# Altium project Open Source Programmable Load.PrjPcb (part 1 of 2)
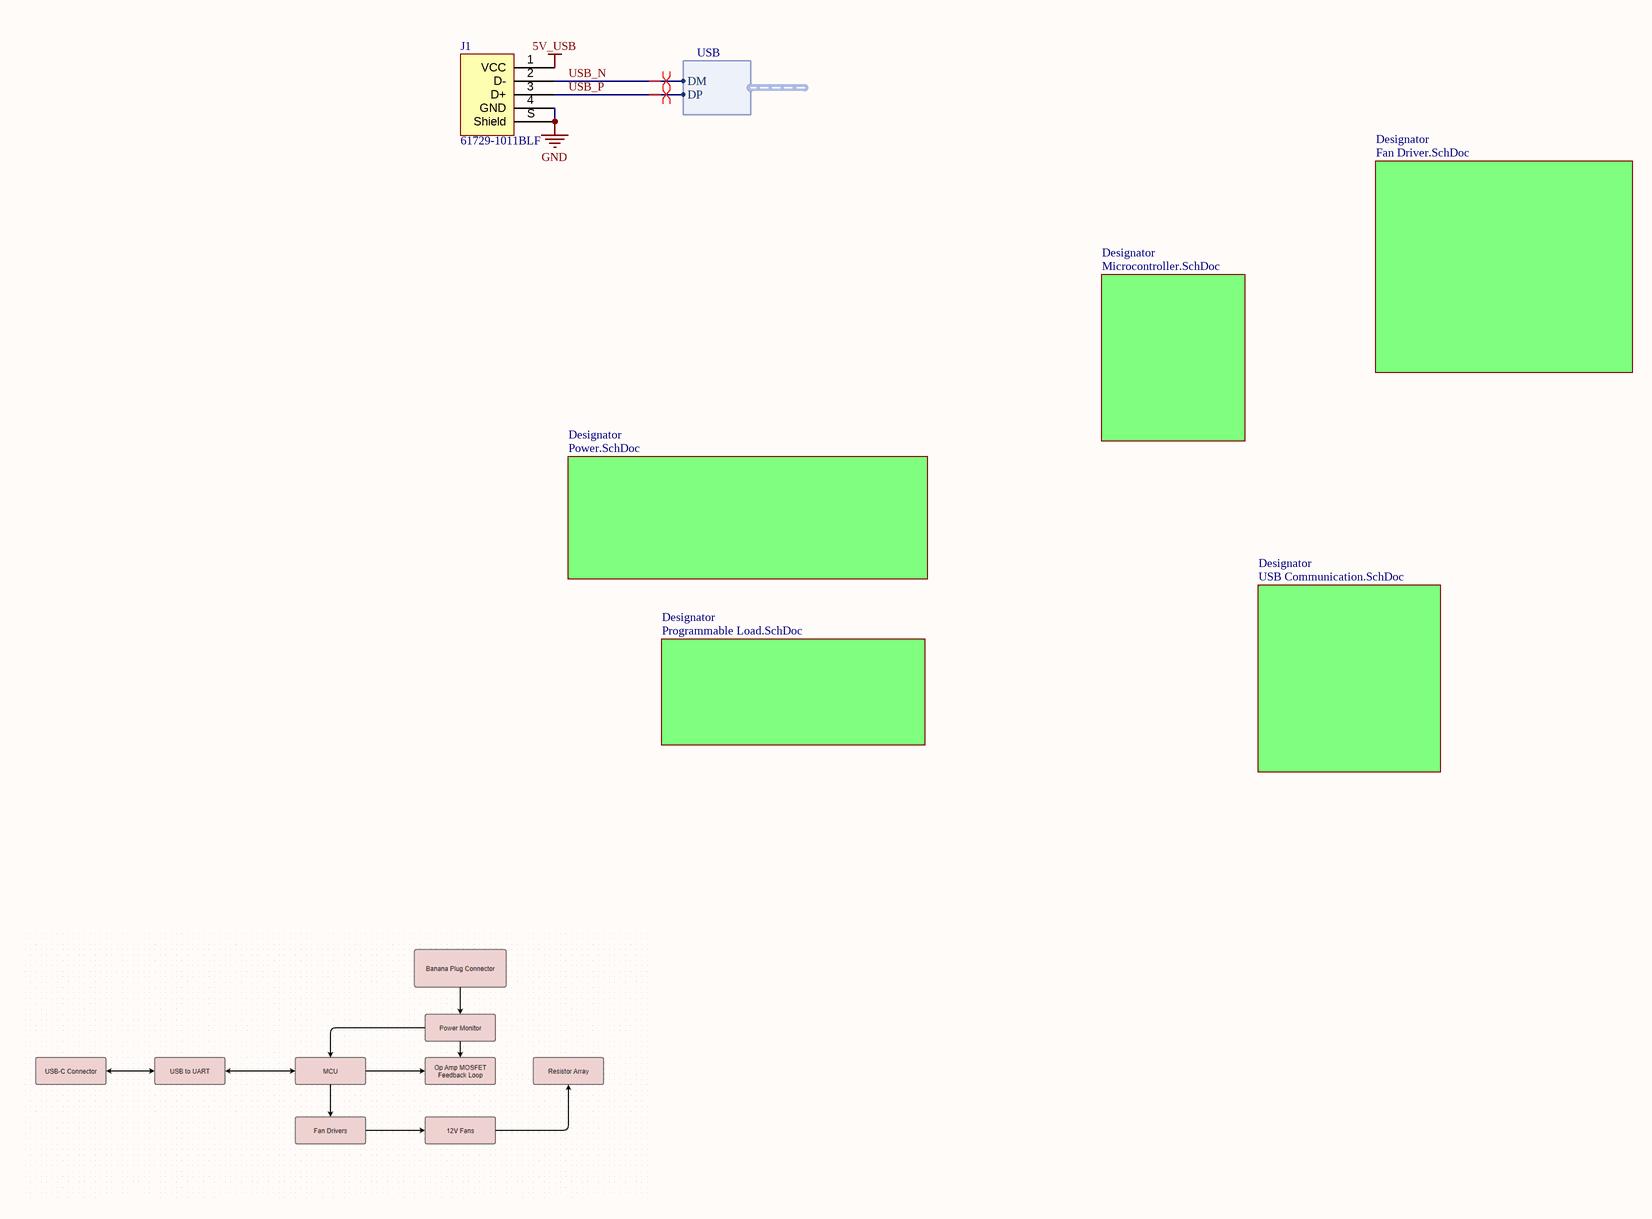
[diagram p0: Top Level.SchDoc]
6 sheets, 92 parts. Net scope: flat (ports and power ports of the same name join across sheets).
Board file: Open Source Programmable Load Main PCB.PcbDoc
Sheets:
  Top Level.SchDoc
    Designator = Microcontroller.SchDoc
    Designator = Programmable Load.SchDoc
    Designator = USB Communication.SchDoc
    Designator = Power.SchDoc
    Designator = Fan Driver.SchDoc

## Sheet Top Level.SchDoc
size 431 x 279 mm; Author: Miguel Manguerra; Revision: A; SheetNumber: 1; SheetTotal: 6

### Parts
J1  61729-1011BLF  [FCI USB 61729-1011BLF]

### Sub-sheets
Designator = Microcontroller.SchDoc: no entries
Designator = Programmable Load.SchDoc: no entries
Designator = USB Communication.SchDoc: no entries
Designator = Power.SchDoc: no entries
Designator = Fan Driver.SchDoc: no entries

### Harnesses
USB: DM, DP

### Nets
5V_USB: J1.1(VCC)
GND: J1.4(GND) J1.S(Shield)
USB_N: J1.2(D-) ; harness USB.DM
USB_P: J1.3(D+) ; harness USB.DP

### Layout directives
differential pair: USB_N, USB_P

### Notes on the sheet
- DWG. NO.
- REV.
- SHT.
- THIS DOCUMENT AND THE DATA DISCLOSED HEREIN OR HEREWITH IS THE PROPERTY OF ALTIUM LIMITED AND MAY BE FREELY DISTRIBUTED IN WHOLE. NO RIGHTS ARE RESERVED OR EXPRESS OR IMPLIED WARANTEE GIVEN.
- REVISION
- DESCRIPTION
- DATE
- APPROVED
- ENG:
- APPROVALS
- PROJECT
- DSN:
- CHK:
- REFERENCE DOCUMENTS
- PROJECT REVISION:
- TITLE
- DOCUMENT REVISION:
- DESIGN ITEM:
- BOM:
- FAB DWG:
- PCB DWG:
- ASSY DWG:
- SCALE:
- SIZE
- B
- CAGE CODE
- FILE NAME
- DWG NO.
- SHEET
- OF
- REV

### Library data of the parts
J1 = 61729-1011BLF: CONN RCPT USB2.0 TYPEB 4POS R/A; Manufacturer: Amphenol ICC (FCI); Connector Type: USB - B; Current Rating (Amps): 1A; Gender: Receptacle; Mating Cycles: 1500; Number of Contacts: 4; Number of Ports: 1; Shielding: Shielded; Part Number: 61729-1011BLF; ComponentLink1Description: Datasheet; ComponentLink1URL: http://www.amphenol-icc.com/media/wysiwyg/files/drawing/61729.pdf; ComponentLink2Description: DigiKey Link; ComponentLink2URL: //digikey.com/product-detail/en/amphenol-icc-fci/61729-1011BLF/609-3657-ND/1490763; Features: Board Lock; LastUpdated: 2019-12-09 8:52:52 PM; Lifecycle Status: 0; Minimum Order: 1; Mounting Feature: Horizontal; Mounting Type: Through Hole, Right Angle; Operating Temperature: -55°C ~ 85°C; Packaging: Tube; Part Status: Active; Price: 0.99; Series: 61729; Specifications: USB 2.0; Supplier 1: DigiKey; Supplier Part Number 1: 609-3657-ND; Termination: Solder

## Sheet Microcontroller.SchDoc
size 431 x 279 mm; SheetNumber: 2; SheetTotal: 6
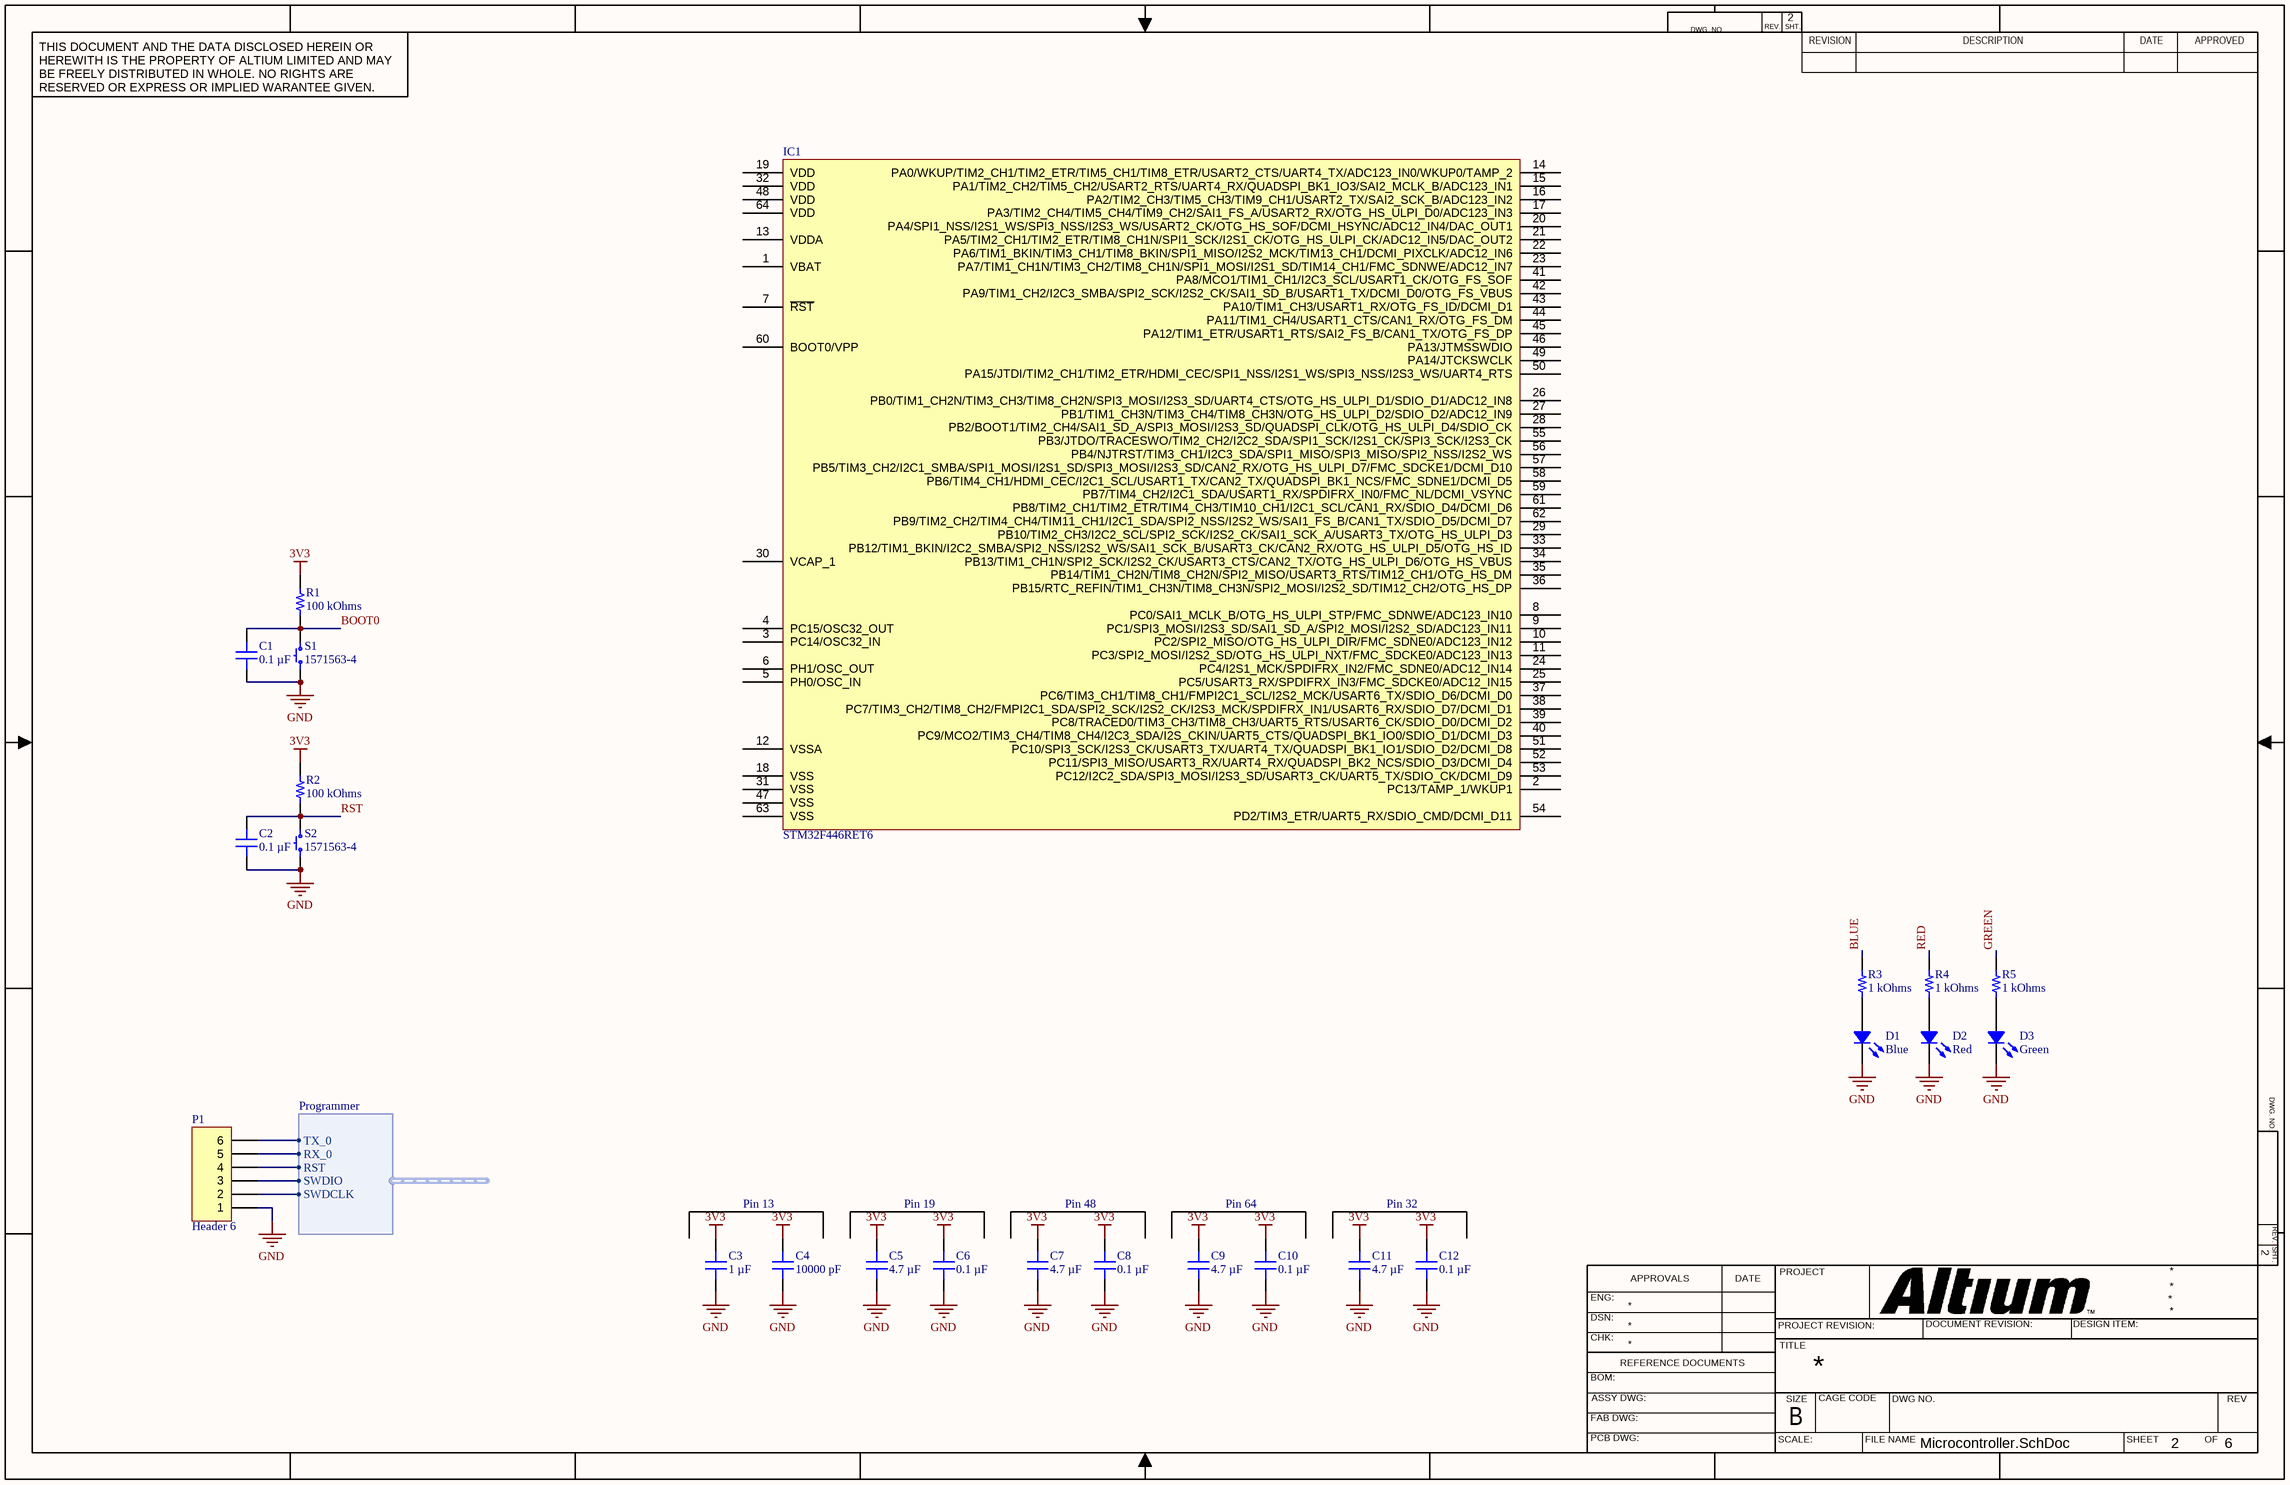
[diagram p1: Microcontroller.SchDoc]

### Parts
C1  0.1 µF  [CAP 0603_1608]
C2  0.1 µF  [CAP 0603_1608]
C3  1 µF  [CAP 0603_1608]
C4  10000 pF  [CAP 0603_1608]
C5  4.7 µF  [CAP 0603_1608]
C6  0.1 µF  [CAP 0603_1608]
C7  4.7 µF  [CAP 0603_1608]
C8  0.1 µF  [CAP 0603_1608]
C9  4.7 µF  [CAP 0603_1608]
C10  0.1 µF  [CAP 0603_1608]
C11  4.7 µF  [CAP 0603_1608]
C12  0.1 µF  [CAP 0603_1608]
D1  Blue  [LED 0603_1608 BLUE]
D2  Red  [LED 0603_1608 RED]
D3  Green  [LED 0603_1608 GREEN]
IC1  STM32F446RET6  [ST LQFP-64 10X10MM]
P1  Header 6  [HDR1X6]
R1  100 kOhms  [RES 0603_1608]
R2  100 kOhms  [RES 0603_1608]
R3  1 kOhms  [RES 0603_1608]
R4  1 kOhms  [RES 0603_1608]
R5  1 kOhms  [RES 0603_1608]
S1  1571563-4  [TE FSM4JSMA]
S2  1571563-4  [TE FSM4JSMA]

### Harnesses
Programmer: TX_0, RX_0, RST, SWDIO, SWDCLK

### Nets
3V3: C3.2 C4.2 C5.2 C6.2 C7.2 C8.2 C9.2 C10.2 C11.2 C12.2 R1.2 R2.2
GND: C1.1 C2.1 C3.1 C4.1 C5.1 C6.1 C7.1 C8.1 C9.1 C10.1 C11.1 C12.1 D1.2 D2.2 D3.2 P1.1 S1.1 S1.2 S2.1 S2.2
BLUE: R3.2
BOOT0: C1.2 R1.1 S1.3 S1.4
GREEN: R5.2
RED: R4.2
RST: C2.2 R2.1 S2.3 S2.4
NetD1_1: D1.1 R3.1
NetD2_1: D2.1 R4.1
NetD3_1: D3.1 R5.1
NetP1_2: P1.2 ; harness Programmer.SWDCLK
NetP1_3: P1.3 ; harness Programmer.SWDIO
NetP1_4: P1.4 ; harness Programmer.RST
NetP1_5: P1.5 ; harness Programmer.RX_0
NetP1_6: P1.6 ; harness Programmer.TX_0

Not connected (* = marked no-connect by the designer): IC1 1(VBAT) 2(PC13/TAMP_1/WKUP1) 3(PC14/OSC32_IN) 4(PC15/OSC32_OUT) 5(PH0/OSC_IN) 6(PH1/OSC_OUT) 7(~{RST}) 8(PC0/SAI1_MCLK_B/OTG_HS_ULPI_STP/FMC_SDNWE/ADC123_IN10) 9(PC1/SPI3_MOSI/I2S3_SD/SAI1_SD_A/SPI2_MOSI/I2S2_SD/ADC123_IN11) 10(PC2/SPI2_MISO/OTG_HS_ULPI_DIR/FMC_SDNE0/ADC123_IN12) 11(PC3/SPI2_MOSI/I2S2_SD/OTG_HS_ULPI_NXT/FMC_SDCKE0/ADC123_IN13) 12(VSSA) 13(VDDA) 14(PA0/WKUP/TIM2_CH1/TIM2_ETR/TIM5_CH1/TIM8_ETR/USART2_CTS/UART4_TX/ADC123_IN0/WKUP0/TAMP_2) 15(PA1/TIM2_CH2/TIM5_CH2/USART2_RTS/UART4_RX/QUADSPI_BK1_IO3/SAI2_MCLK_B/ADC123_IN1) 16(PA2/TIM2_CH3/TIM5_CH3/TIM9_CH1/USART2_TX/SAI2_SCK_B/ADC123_IN2) 17(PA3/TIM2_CH4/TIM5_CH4/TIM9_CH2/SAI1_FS_A/USART2_RX/OTG_HS_ULPI_D0/ADC123_IN3) 18(VSS) 19(VDD) 20(PA4/SPI1_NSS/I2S1_WS/SPI3_NSS/I2S3_WS/USART2_CK/OTG_HS_SOF/DCMI_HSYNC/ADC12_IN4/DAC_OUT1) 21(PA5/TIM2_CH1/TIM2_ETR/TIM8_CH1N/SPI1_SCK/I2S1_CK/OTG_HS_ULPI_CK/ADC12_IN5/DAC_OUT2) 22(PA6/TIM1_BKIN/TIM3_CH1/TIM8_BKIN/SPI1_MISO/I2S2_MCK/TIM13_CH1/DCMI_PIXCLK/ADC12_IN6) 23(PA7/TIM1_CH1N/TIM3_CH2/TIM8_CH1N/SPI1_MOSI/I2S1_SD/TIM14_CH1/FMC_SDNWE/ADC12_IN7) 24(PC4/I2S1_MCK/SPDIFRX_IN2/FMC_SDNE0/ADC12_IN14) 25(PC5/USART3_RX/SPDIFRX_IN3/FMC_SDCKE0/ADC12_IN15) 26(PB0/TIM1_CH2N/TIM3_CH3/TIM8_CH2N/SPI3_MOSI/I2S3_SD/UART4_CTS/OTG_HS_ULPI_D1/SDIO_D1/ADC12_IN8) 27(PB1/TIM1_CH3N/TIM3_CH4/TIM8_CH3N/OTG_HS_ULPI_D2/SDIO_D2/ADC12_IN9) 28(PB2/BOOT1/TIM2_CH4/SAI1_SD_A/SPI3_MOSI/I2S3_SD/QUADSPI_CLK/OTG_HS_ULPI_D4/SDIO_CK) 29(PB10/TIM2_CH3/I2C2_SCL/SPI2_SCK/I2S2_CK/SAI1_SCK_A/USART3_TX/OTG_HS_ULPI_D3) 30(VCAP_1) 31(VSS) 32(VDD) 33(PB12/TIM1_BKIN/I2C2_SMBA/SPI2_NSS/I2S2_WS/SAI1_SCK_B/USART3_CK/CAN2_RX/OTG_HS_ULPI_D5/OTG_HS_ID) 34(PB13/TIM1_CH1N/SPI2_SCK/I2S2_CK/USART3_CTS/CAN2_TX/OTG_HS_ULPI_D6/OTG_HS_VBUS) 35(PB14/TIM1_CH2N/TIM8_CH2N/SPI2_MISO/USART3_RTS/TIM12_CH1/OTG_HS_DM) 36(PB15/RTC_REFIN/TIM1_CH3N/TIM8_CH3N/SPI2_MOSI/I2S2_SD/TIM12_CH2/OTG_HS_DP) 37(PC6/TIM3_CH1/TIM8_CH1/FMPI2C1_SCL/I2S2_MCK/USART6_TX/SDIO_D6/DCMI_D0) 38(PC7/TIM3_CH2/TIM8_CH2/FMPI2C1_SDA/SPI2_SCK/I2S2_CK/I2S3_MCK/SPDIFRX_IN1/USART6_RX/SDIO_D7/DCMI_D1) 39(PC8/TRACED0/TIM3_CH3/TIM8_CH3/UART5_RTS/USART6_CK/SDIO_D0/DCMI_D2) 40(PC9/MCO2/TIM3_CH4/TIM8_CH4/I2C3_SDA/I2S_CKIN/UART5_CTS/QUADSPI_BK1_IO0/SDIO_D1/DCMI_D3) 41(PA8/MCO1/TIM1_CH1/I2C3_SCL/USART1_CK/OTG_FS_SOF) 42(PA9/TIM1_CH2/I2C3_SMBA/SPI2_SCK/I2S2_CK/SAI1_SD_B/USART1_TX/DCMI_D0/OTG_FS_VBUS) 43(PA10/TIM1_CH3/USART1_RX/OTG_FS_ID/DCMI_D1) 44(PA11/TIM1_CH4/USART1_CTS/CAN1_RX/OTG_FS_DM) 45(PA12/TIM1_ETR/USART1_RTS/SAI2_FS_B/CAN1_TX/OTG_FS_DP) 46(PA13/JTMSSWDIO) 47(VSS) 48(VDD) 49(PA14/JTCKSWCLK) 50(PA15/JTDI/TIM2_CH1/TIM2_ETR/HDMI_CEC/SPI1_NSS/I2S1_WS/SPI3_NSS/I2S3_WS/UART4_RTS) 51(PC10/SPI3_SCK/I2S3_CK/USART3_TX/UART4_TX/QUADSPI_BK1_IO1/SDIO_D2/DCMI_D8) 52(PC11/SPI3_MISO/USART3_RX/UART4_RX/QUADSPI_BK2_NCS/SDIO_D3/DCMI_D4) 53(PC12/I2C2_SDA/SPI3_MOSI/I2S3_SD/USART3_CK/UART5_TX/SDIO_CK/DCMI_D9) 54(PD2/TIM3_ETR/UART5_RX/SDIO_CMD/DCMI_D11) 55(PB3/JTDO/TRACESWO/TIM2_CH2/I2C2_SDA/SPI1_SCK/I2S1_CK/SPI3_SCK/I2S3_CK) 56(PB4/NJTRST/TIM3_CH1/I2C3_SDA/SPI1_MISO/SPI3_MISO/SPI2_NSS/I2S2_WS) 57(PB5/TIM3_CH2/I2C1_SMBA/SPI1_MOSI/I2S1_SD/SPI3_MOSI/I2S3_SD/CAN2_RX/OTG_HS_ULPI_D7/FMC_SDCKE1/DCMI_D10) 58(PB6/TIM4_CH1/HDMI_CEC/I2C1_SCL/USART1_TX/CAN2_TX/QUADSPI_BK1_NCS/FMC_SDNE1/DCMI_D5) 59(PB7/TIM4_CH2/I2C1_SDA/USART1_RX/SPDIFRX_IN0/FMC_NL/DCMI_VSYNC) 60(BOOT0/VPP) 61(PB8/TIM2_CH1/TIM2_ETR/TIM4_CH3/TIM10_CH1/I2C1_SCL/CAN1_RX/SDIO_D4/DCMI_D6) 62(PB9/TIM2_CH2/TIM4_CH4/TIM11_CH1/I2C1_SDA/SPI2_NSS/I2S2_WS/SAI1_FS_B/CAN1_TX/SDIO_D5/DCMI_D7) 63(VSS) 64(VDD)

### Notes on the sheet
- Pin 13
- Pin 19
- Pin 48
- Pin 64
- Pin 32
- DWG. NO.
- REV.
- SHT.
- THIS DOCUMENT AND THE DATA DISCLOSED HEREIN OR HEREWITH IS THE PROPERTY OF ALTIUM LIMITED AND MAY BE FREELY DISTRIBUTED IN WHOLE. NO RIGHTS ARE RESERVED OR EXPRESS OR IMPLIED WARANTEE GIVEN.
- REVISION
- DESCRIPTION
- DATE
- APPROVED
- ENG:
- APPROVALS
- PROJECT
- DSN:
- CHK:
- REFERENCE DOCUMENTS
- PROJECT REVISION:
- TITLE
- DOCUMENT REVISION:
- DESIGN ITEM:
- BOM:
- FAB DWG:
- PCB DWG:
- ASSY DWG:
- SCALE:
- SIZE
- B
- CAGE CODE
- FILE NAME
- DWG NO.
- SHEET
- OF
- REV

### Library data of the parts
C1 C2 C6 C8 C10 C12 = C0603C104K5RAC7411: CAP CER 0.1UF 50V X7R 0603; manufacturer: KEMET; Tolerance: ±10%; Part Number: C0603C104K5RAC7411; Value: 0.1 µF; Applications: Bypass, Decoupling; Capacitance: 0.1 µF; componentlink1description: Datasheet; componentlink1url: https://api.kemet.com/component-edge/download/datasheet/C0603C104K5RAC7411.pdf; componentlink2description: DigiKey Link; componentlink2url: https://www.digikey.com/en/products/detail/kemet/C0603C104K5RAC7411/3317013; Device Package: 0603 (1608 Metric); lastupdated: 2022-09-13 6:40:53 AM; Lifecycle Status: Active; Minimum Order: 15000; Mounting Type: Surface Mount, MLCC; Operating Temperature: -55°C ~ 125°C; Package / Case: 0603 (1608 Metric); packaging: TapeAndReel; partid: 2233; Part Status: Active; price: 0.01; series: SMD Comm X7R; Size / Dimension: 0.063" L x 0.031" W (1.60mm x 0.80mm); Supplier 1: DigiKey; Supplier Part Number 1: 399-7374-2-ND; Temperature Coefficient: X7R; Thickness (Max): 0.035" (0.90mm); Voltage - Rated: 50V
C3 = CC0603KRX7R6BB105: CAP CER 1UF 10V X7R 0603; manufacturer: Yageo; Tolerance: ±10%; Part Number: CC0603KRX7R6BB105; Value: 1 µF; Applications: General Purpose; Capacitance: 1 µF; componentlink1description: Datasheet; componentlink1url: https://www.yageo.com/upload/media/product/productsearch/datasheet/mlcc/UPY-GPHC_X7R_6.3V-to-50V_18.pdf; componentlink2description: DigiKey Link; componentlink2url: https://www.digikey.com/en/products/detail/yageo/CC0603KRX7R6BB105/5195204; Device Package: 0603 (1608 Metric); lastupdated: 2022-09-13 6:40:53 AM; Lifecycle Status: Active; Minimum Order: 1; Mounting Type: Surface Mount, MLCC; Operating Temperature: -55°C ~ 125°C; Package / Case: 0603 (1608 Metric); packaging: TapeAndReel; partid: 2290; Part Status: Active; price: 0.02; series: CC; Size / Dimension: 0.063" L x 0.031" W (1.60mm x 0.80mm); Supplier 1: DigiKey; Supplier Part Number 1: 311-1796-1-ND; Temperature Coefficient: X7R; Thickness (Max): 0.035" (0.90mm); Voltage - Rated: 10V
C4 = C0603C103K4RECAUTO: CAP CER 0603 10NF 16V X7R 10%; manufacturer: KEMET; Part Number: C0603C103K4RECAUTO; Value: 10000 pF; Applications: Automotive, ESD Protection; Capacitance: 10000 pF; componentlink1description: Datasheet; componentlink1url: https://api.kemet.com/component-edge/download/datasheet/C0603C103K4RECAUTO.pdf; componentlink2description: DigiKey Link; componentlink2url: https://www.digikey.com/en/products/detail/kemet/C0603C103K4RECAUTO/8640474; Device Package: 0603 (1608 Metric); lastupdated: 2022-09-13 6:40:37 AM; Lifecycle Status: Active; Minimum Order: 1; Mounting Type: Surface Mount, MLCC; Operating Temperature: -55°C ~ 125°C; Package / Case: 0603 (1608 Metric); packaging: TapeAndReel; partid: 8251; Part Status: Active; price: 0.01; Ratings: AEC-Q200; series: ESD SMD Auto X7R; Size / Dimension: 0.063" L x 0.031" W (1.60mm x 0.80mm); Supplier 1: DigiKey; Supplier Part Number 1: 399-17880-1-ND; Temperature Coefficient: X7R; Thickness (Max): 0.034" (0.87mm); Tolerance: ±10%; Voltage - Rated: 16V
C5 C7 C9 C11 = CL10A475KP8NNNC: CAP CER 4.7UF 10V X5R 0603; manufacturer: Samsung Electro-Mechanics; Tolerance: ±10%; Part Number: CL10A475KP8NNNC; Value: 4.7 µF; Applications: General Purpose; Capacitance: 4.7 µF; componentlink1description: Datasheet; componentlink1url: http://www.samsungsem.com/kr/support/product-search/mlcc/CL10A475KP8NNNC.jsp; componentlink2description: DigiKey Link; componentlink2url: https://www.digikey.com/en/products/detail/samsung-electro-mechanics/CL10A475KP8NNNC/3886702; Device Package: 0603 (1608 Metric); lastupdated: 2022-09-13 6:40:44 AM; Lifecycle Status: Active; Minimum Order: 1; Mounting Type: Surface Mount, MLCC; Operating Temperature: -55°C ~ 85°C; Package / Case: 0603 (1608 Metric); packaging: TapeAndReel; partid: 5671; Part Status: Active; price: 0.01; series: CL; Size / Dimension: 0.063" L x 0.031" W (1.60mm x 0.80mm); Supplier 1: DigiKey; Supplier Part Number 1: 1276-1044-1-ND; Temperature Coefficient: X5R; Thickness (Max): 0.035" (0.90mm); Voltage - Rated: 10V
D1 = LTST-C193TBKT-5A: LED BLUE CLEAR CHIP SMD; Manufacturer: Lite-On Inc.; Configuration: Standard; Current - Test: 5mA; Lens Color: Colorless; Lens Size: 1.15mm x 0.80mm; Lens Style: Rectangle with Flat Top; Millicandela Rating: 15mcd; Viewing Angle: 130°; Voltage - Forward (Vf) (Typ): 2.8V; Wavelength - Dominant: 470nm; Wavelength - Peak: 468nm; Part Number: LTST-C193TBKT-5A; Color: Blue; ComponentLink1Description: Datasheet; ComponentLink1URL: //media.digikey.com/pdf/Data%20Sheets/Lite-On%20PDFs/LTST-C193TBKT-5A.pdf; ComponentLink2Description: DigiKey Link; ComponentLink2URL: http://digikey.com/product-detail/en/lite-on-inc/LTST-C193TBKT-5A/160-1827-1-ND/2355044; Device Package: 0603 (1608 Metric); Height (Max): 0.45mm; LastUpdated: 2022-09-13 7:29:17 AM; Lens Transparency: Clear; Lifecycle Status: Active; Minimum Order: 1; Mounting Type: Surface Mount; Package / Case: 0603 (1608 Metric); Packaging: TapeAndReel; PartId: 829; Part Status: Active; Price: 0.06; Series: -; Size / Dimension: 1.60mm L x 0.80mm W; Supplier 1: DigiKey; Supplier Part Number 1: 160-1827-1-ND; Supplier Device Package: Chip LED; Value: Blue
D2 = LTST-C190KAKT: LED RED CLEAR CHIP SMD; Manufacturer: Lite-On Inc.; Configuration: Standard; Current - Test: 20mA; Lens Color: Colorless; Lens Size: 1.06mm x 0.80mm; Lens Style: Rectangle with Flat Top; Millicandela Rating: 80mcd; Viewing Angle: 130°; Voltage - Forward (Vf) (Typ): 2V; Wavelength - Dominant: 615nm; Wavelength - Peak: 621nm; Part Number: LTST-C190KAKT; Color: Red; ComponentLink1Description: Datasheet; ComponentLink1URL: //media.digikey.com/pdf/Data%20Sheets/Lite-On%20PDFs/LTST-C150,170,190KxKT.pdf; ComponentLink2Description: DigiKey Link; ComponentLink2URL: http://digikey.com/product-detail/en/lite-on-inc/LTST-C190KAKT/160-1433-1-ND/386810; Device Package: 0603 (1608 Metric); Height (Max): 0.90mm; LastUpdated: 2022-09-13 7:29:57 AM; Lens Transparency: Clear; Lifecycle Status: Active; Minimum Order: 1; Mounting Type: Surface Mount; Package / Case: 0603 (1608 Metric); Packaging: TapeAndReel; PartId: 384; Part Status: Active; Price: 0.07; Series: -; Size / Dimension: 1.60mm L x 0.80mm W; Supplier 1: DigiKey; Supplier Part Number 1: 160-1433-1-ND; Supplier Device Package: Chip LED; Value: Red
D3 = XZVGT53W-6: LED GREEN CLEAR 2SMD; Manufacturer: SunLED; Configuration: Standard; Current - Test: 20mA; Lens Color: Colorless; Lens Size: 1.20mm x 0.80mm; Lens Style: Rectangle with Flat Top; Millicandela Rating: 49mcd; Viewing Angle: 120°; Voltage - Forward (Vf) (Typ): 2.1V; Wavelength - Dominant: 570nm; Wavelength - Peak: 574nm; Part Number: XZVGT53W-6; Color: Green; ComponentLink1Description: Datasheet; ComponentLink1URL: https://www.sunledusa.com/products/spec/XZVGT53W-6.pdf; ComponentLink2Description: DigiKey Link; ComponentLink2URL: https://www.digikey.com/en/products/detail/sunled/XZVGT53W-6/4902128; Device Package: 0603 (1608 Metric); Height (Max): 0.28mm; LastUpdated: 2022-09-13 7:29:38 AM; Lens Transparency: Clear; Lifecycle Status: Active; Minimum Order: 1; Mounting Type: Surface Mount; Package / Case: 0603 (1608 Metric); Packaging: TapeAndReel; PartId: 581; Part Status: Active; Price: 0.05; Series: -; Size / Dimension: 1.60mm L x 0.80mm W; Supplier 1: DigiKey; Supplier Part Number 1: 1497-1243-1-ND; Supplier Device Package: 2-SMD; Value: Green
IC1 = STM32F446RET6: IC MCU 32BIT 512KB FLASH 64LQFP; Manufacturer: STMicroelectronics; Connectivity: CANbus, EBI/EMI, I²C, IrDA, LINbus, SAI, SD, SPDIF-Rx, SPI, UART/USART, USB, USB OTG; Core Processor: ARM® Cortex®-M4; Core Size: 32-Bit; Data Converters: A/D 16x12b; D/A 2x12b; Number of I/O: 50; Oscillator Type: Internal; Peripherals: Brown-out Detect/Reset, DMA, I²S, LVD, POR, PWM, WDT; Program Memory Size: 512KB (512K x 8); RAM Size: 128K x 8; Speed: 180MHz; Voltage - Supply (Vcc/Vdd): 1.7V ~ 3.6V; Part Number: STM32F446RET6; ComponentLink1Description: Datasheet; ComponentLink1URL: http://www.st.com/content/ccc/resource/technical/document/datasheet/65/cb/75/50/53/d6/48/24/DM00141306.pdf/files/DM00141306.pdf/jcr:content/translations/en.DM00141306.pdf; ComponentLink2Description: DigiKey Link; ComponentLink2URL: http://digikey.com/product-detail/en/stmicroelectronics/STM32F446RET6/497-15376-ND/5175962; LastUpdated: 2022-09-13 7:33:02 AM; Lifecycle Status: Active; Minimum Order: 1; Mounting Type: Surface Mount; Operating Temperature: -40°C ~ 85°C (TA); Package / Case: 64-LQFP; Packaging: Tray; PartId: 121; Part Status: Active; Price: 7.28; Program Memory Type: FLASH; Series: STM32F4; Supplier 1: DigiKey; Supplier Part Number 1: 497-15376-ND; Supplier Device Package: 64-LQFP (10x10)
P1 = Header 6: Header, 6-Pin; LatestRevisionDate: 17-Jul-2002; LatestRevisionNote: Re-released for DXP Platform.; Publisher: Altium Limited
R1 R2 = CRCW0603100KFKEAC: RES 100K OHM 1% 1/10W 0603; Manufacturer: Vishay Dale; Power (Watts): 0.1W, 1/10W; Temperature Coefficient: ±100ppm/°C; Part Number: CRCW0603100KFKEAC; Value: 100 kOhms; ComponentLink1Description: Datasheet; ComponentLink1URL: http://www.vishay.com/docs/28773/crcwce3.pdf; ComponentLink2Description: DigiKey Link; ComponentLink2URL: https://www.digikey.com/en/products/detail/vishay-dale/CRCW0603100KFKEAC/7928372; Composition: Thick Film; Device Package: 0603 (1608 Metric); Height - Seated (Max): 0.022" (0.55mm); LastUpdated: 2022-09-13 7:03:10 AM; Lifecycle Status: Active; Minimum Order: 1; Number of Terminations: 2; Operating Temperature: -55°C ~ 155°C; Package / Case: 0603 (1608 Metric); Packaging: CutTape; PartId: 12549; Part Status: Active; Price: 0.01; Resistance: 100 kOhms; Series: CRCW-C; Supplier 1: DigiKey; Supplier Part Number 1: 541-3950-1-ND; Supplier Device Package: 0603; Tolerance: ±1%
R3-R5 = RT0603FRE071KL: RES SMD 1K OHM 1% 1/10W 0603; Manufacturer: Yageo; Power (Watts): 0.1W, 1/10W; Temperature Coefficient: ±50ppm/°C; Part Number: RT0603FRE071KL; Value: 1 kOhms; ComponentLink1Description: Datasheet; ComponentLink1URL: https://www.yageo.com/upload/media/product/productsearch/datasheet/rchip/PYu-RT_1-to-0.01_RoHS_L_11.pdf; ComponentLink2Description: DigiKey Link; ComponentLink2URL: https://www.digikey.com/en/products/detail/yageo/RT0603FRE071KL/1075188; Composition: Thin Film; Device Package: 0603 (1608 Metric); Height - Seated (Max): 0.022" (0.55mm); LastUpdated: 2022-09-14 8:09:45 AM; Lifecycle Status: Active; Minimum Order: 1; Number of Terminations: 2; Operating Temperature: -55°C ~ 155°C; Package / Case: 0603 (1608 Metric); Packaging: TapeAndReel; PartId: 5672; Part Status: Active; Price: 0.01; Resistance: 1 kOhms; Series: RT; Size / Dimension: 0.063" L x 0.031" W (1.60mm x 0.80mm); Supplier 1: DigiKey; Supplier Part Number 1: YAG2323CT-ND; Supplier Device Package: 0603; Tolerance: ±1%
S1 S2 = 1571563-4: SWITCH TACTILE SPST-NO 0.05A 24V; Manufacturer: TE Connectivity ALCOSWITCH Switches; Actuator Height off PCB, Vertical: 5.00mm; Actuator Orientation: Top Actuated; Actuator Type: Standard; Contact Rating @ Voltage: 0.05A @ 24VDC; Illumination: Non-Illuminated; Operating Force: 260gf; Outline: 6.00mm x 6.00mm; Switch Function: Off-Mom; Part Number: 1571563-4; Circuit: SPST-NO; ComponentLink1Description: Datasheet; ComponentLink1URL: https://www.te.com/commerce/DocumentDelivery/DDEController?Action=srchrtrv&DocNm=1308111-1_SWITCHES_CORE_PROGRAM_CATALOG&DocType=CS&DocLang=English; ComponentLink2Description: DigiKey Link; ComponentLink2URL: https://www.digikey.com/en/products/detail/te-connectivity-alcoswitch-switches/1571563-4/2400231; LastUpdated: 2022-09-13 7:41:06 AM; Lifecycle Status: Active; Minimum Order: 1; Mounting Type: Surface Mount; Operating Temperature: -35°C ~ 85°C; Packaging: TapeAndReel; Part Status: Active; Price: 0.16; Series: FSMJSMA; Supplier 1: DigiKey; Supplier Part Number 1: 450-2055-1-ND; Termination Style: Gull Wing

## Sheet Programmable Load.SchDoc
size 431 x 279 mm; SheetNumber: 5; SheetTotal: 6
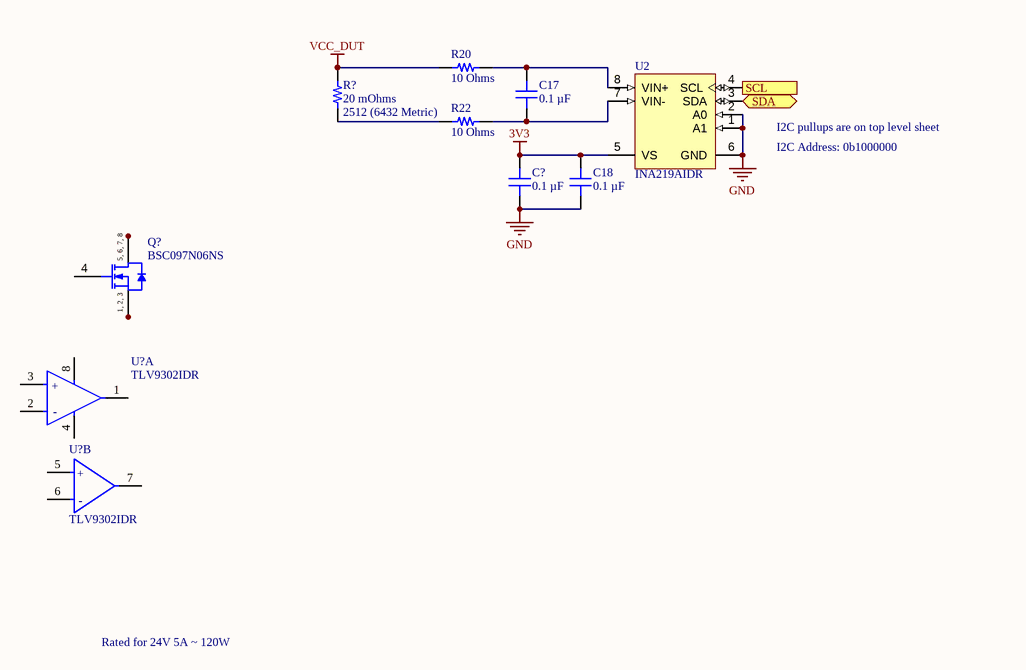
[diagram p2: Programmable Load.SchDoc]

### Parts
(Parts that share a designator on the sheet are numbered #1, #2 ... from top to bottom, then left to right.)
C17  0.1 µF  [CAP 0603_1608]
C18  0.1 µF  [CAP 0603_1608]
C?  0.1 µF  [CAP 0603_1608]
Q?  BSC097N06NS  [INF-PG-TDSON-8-04_V]
R20  10 Ohms  [RES 0603_1608]
R22  10 Ohms  [RES 0603_1608]
R?  20 mOhms  Package / Case: 2512 (6432 Metric)  [STACKPOLE CSR2512]
U2  INA219AIDR  [D0008A_L]
U?#1  TLV9302IDR  [FP-D0008A-IPC_A]  (part A of 2)
U?#2  TLV9302IDR  [FP-D0008A-IPC_A]  (part B of 2)

### Ports
SCL (in), SDA (bidir)

### Nets
3V3: C18.2 C?.2 U2.5(VS)
GND: C18.1 C?.1 U2.1(A1) U2.2(A0) U2.6(GND)
VCC_DUT: R20.1 R?.2
NetC17_1: C17.1 R22.2 U2.7(VIN-)
NetC17_2: C17.2 R20.2 U2.8(VIN+)
NetQ?_1: Q?.1(SOURCE) Q?.2(SOURCE) Q?.3(SOURCE)
NetQ?_5: Q?.5(DRAIN) Q?.6(DRAIN) Q?.7(DRAIN) Q?.8(DRAIN)
NetR22_1: R22.1 R?.1
NetU2_3: U2.3(SDA) ; port SDA
NetU2_4: U2.4(SCL) ; port SCL

Not connected (* = marked no-connect by the designer): Q? 4(GATE); U?#1 1(OUT1) 2(IN1-) 3(IN1+) 4(V-) 8(V+); U?#2 5(IN2+) 6(IN2-) 7(OUT2)

### Notes on the sheet
- I2C pullups are on top level sheet
- I2C Address: 0b1000000
- Rated for 24V 5A ~ 120W
- DWG. NO.
- REV.
- SHT.
- THIS DOCUMENT AND THE DATA DISCLOSED HEREIN OR HEREWITH IS THE PROPERTY OF ALTIUM LIMITED AND MAY BE FREELY DISTRIBUTED IN WHOLE. NO RIGHTS ARE RESERVED OR EXPRESS OR IMPLIED WARANTEE GIVEN.
- REVISION
- DESCRIPTION
- DATE
- APPROVED
- ENG:
- APPROVALS
- PROJECT
- DSN:
- CHK:
- REFERENCE DOCUMENTS
- PROJECT REVISION:
- TITLE
- DOCUMENT REVISION:
- DESIGN ITEM:
- BOM:
- FAB DWG:
- PCB DWG:
- ASSY DWG:
- SCALE:
- SIZE
- B
- CAGE CODE
- FILE NAME
- DWG NO.
- SHEET
- OF
- REV
- (in symbol CMP-1091-00019-1) 5, 6, 7, 8; 1, 2, 3
- (in symbol CMP-04895-000152-1, part A) +; -
- (in symbol CMP-04895-000152-1, part B) +; -

### Library data of the parts
C17 C18 C? = C0603C104K5RAC7411: as C1 on sheet Microcontroller; Part Number: C0603C104K5RAC7411; Value: 0.1 µF; Applications: Bypass, Decoupling; Capacitance: 0.1 µF; componentlink1description: Datasheet; componentlink1url: https://api.kemet.com/component-edge/download/datasheet/C0603C104K5RAC7411.pdf; componentlink2description: DigiKey Link; componentlink2url: https://www.digikey.com/en/products/detail/kemet/C0603C104K5RAC7411/3317013; Device Package: 0603 (1608 Metric); lastupdated: 2022-09-13 6:40:53 AM; Lifecycle Status: Active; Minimum Order: 15000; Mounting Type: Surface Mount, MLCC; Operating Temperature: -55°C ~ 125°C; Package / Case: 0603 (1608 Metric); packaging: TapeAndReel; partid: 2233; Part Status: Active; price: 0.01; series: SMD Comm X7R; Size / Dimension: 0.063" L x 0.031" W (1.60mm x 0.80mm); Supplier 1: DigiKey; Supplier Part Number 1: 399-7374-2-ND; Temperature Coefficient: X7R; Thickness (Max): 0.035" (0.90mm); Voltage - Rated: 50V
Q? = CMP-1091-00019-1: N-Channel OptiMOS(TM) Power-Transistor, 60 V VDS, 46 A ID, -55 to 150 degC, PG-TDSON-8, Reel, Green; Manufacturer: Infineon; RDS (on) (max): 9.7Â mOhm; VGS(th) (max): 3.3Â V; RthJA (max): 50Â K/W; VDS (max): 60Â V; Polarity: N; Green: TRUE; RthJC (max): 3.5Â K/W; Ptot (max): 36Â W; ID (max): 46Â A; IDpuls (max): 184Â A; VGS(th) (min): 2.1Â V; Technology: OptiMOS(TM); ComponentLink1Description: Manufacturer URL; PackageDescription: 8-Pin Plastic (Green) Thin Dual Small Outline Non-Leaded Package, 5.9 x 5.15 mm Body, 1.27 mm Pitch; Halogen-free: TRUE; Packing: Reel; DatasheetVersion: Rev. 2.0; ComponentLink3URL: http://www.infineon.com/dgdl/BSC019N04LS_rev2.0.pdf?folderId=db3a304313b8b5a60113cee8763b02d7&fileId=db3a304342371bb001424b8aca0c6fc4; PackageVersion: Rev. 04, 04/2013; Mounting Technology: Surface Mount; Mounting: SMD; PartNumber: BSC097N06NS; ComponentLink2URL: http://www.infineon.com/dgdl/BSC097N06NS_Rev2.0.pdf?folderId=db3a304313b8b5a60113cee8763b02d7&fileId=db3a304342371bb001424cdd69b87155; ComponentLink2Description: Datasheet; ComponentLink3Description: Package Specification; ComponentLink1URL: http://www.infineon.com/; PackageReference: PG-TDSON-8-04
R20 R22 = ERJ-PA3F10R0V: RES SMD 10 OHM 1% 1/3W 0603; Manufacturer: Panasonic Electronic Components; Power (Watts): 0.333W, 1/3W; Temperature Coefficient: ±100ppm/°C; Part Number: ERJ-PA3F10R0V; Value: 10 Ohms; ComponentLink1Description: Datasheet; ComponentLink1URL: https://industrial.panasonic.com/cdbs/www-data/pdf/RDO0000/AOA0000C331.pdf; ComponentLink2Description: DigiKey Link; ComponentLink2URL: https://www.digikey.com/en/products/detail/panasonic-electronic-components/ERJ-PA3F10R0V/5035852; Composition: Thick Film; Device Package: 0603 (1608 Metric); Features: Automotive AEC-Q200, Pulse Withstanding; Height - Seated (Max): 0.022" (0.55mm); LastUpdated: 2023-01-02 8:30:25 PM; Lifecycle Status: Active; Minimum Order: 1; Number of Terminations: 2; Operating Temperature: -55°C ~ 155°C; Package / Case: 0603 (1608 Metric); Packaging: TapeAndReel; PartId: 5368; Part Status: Active; Price: 0.01; Ratings: AEC-Q200; Resistance: 10 Ohms; Series: ERJ-PA3; Size / Dimension: 0.063" L x 0.031" W (1.60mm x 0.80mm); Supplier 1: DigiKey; Supplier Part Number 1: P10.00BYCT-ND; Supplier Device Package: 0603; Tolerance: ±1%
R? = CSRN2512FK20L0: RES 0.02 OHM 1% 2W 2512; Manufacturer: Stackpole Electronics Inc; Temperature Coefficient: ±200ppm/°C; Part Number: CSRN2512FK20L0; ComponentLink1Description: Datasheet; ComponentLink1URL: https://www.seielect.com/catalog/sei-csr_csrn.pdf; ComponentLink2Description: DigiKey Link; ComponentLink2URL: https://www.digikey.com/en/products/detail/stackpole-electronics-inc/CSRN2512FK20L0/1646105; Composition: Thick Film; Device Package: 2512 (6432 Metric); Features: Current Sense; Height - Seated (Max): 0.028" (0.70mm); LastUpdated: 2022-02-17 6:43:57 PM; Lifecycle Status: Active; Minimum Order: 1; Number of Terminations: 2; Operating Temperature: -55°C ~ 155°C; Packaging: TapeAndReel; PartId: 1775; Part Status: Active; Power (Watts): 2W; Price: 0.15; Resistance: 20 mOhms; Series: CSRN; Size / Dimension: 0.250" L x 0.124" W (6.35mm x 3.15mm); Supplier 1: DigiKey; Supplier Part Number 1: CSRN2512FK20L0CT-ND; Supplier Device Package: 2512; Tolerance: ±1%; Value: 20 mOhms
U2 = CMP-0704-00003-2: Zero-Drift, Bi-Directional Current / Power Monitor, 3 to 5.5 V, -40 to 125 degC, 8-pin SOIC (D8), Green (RoHS & no Sb/Br); Manufacturer: Texas Instruments; Common Mode Range(Min)(V): 0; SubFamily: Current Shunt Monitor; Rating: Catalog; Input Offset (+/-)(Max)(uV): 100; Vs(Max)(V): 5.5; Common Mode Range(Max)(V): 26; Quiescent Current (+/-)(Typ)(mA): 0.7; Vs(Min)(V): 3; Gain(V/V): 1, 0.5, 0.25, 0.125; Small-Signal Bandwidth(Typ)(MHz): 0.011; PackageReference: D0008A; ComponentLink1URL: http://www.ti.com/; Eco-Plan: Green (RoHS & no Sb/Br); ComponentLink2URL: http://www.ti.com/general/docs/lit/getliterature.tsp?genericPartNumber=INA219&fileType=pdf; ComponentLink1Description: Manufacturer URL; ComponentLink3Description: Package Specification; Mounting Technology: Surface Mount; PackageDescription: 8-Pin Plastic Small Outline, Body 4.9 x 3.9 mm, Pitch 1.27 mm; ComponentLink3URL: http://www.ti.com/lit/ml/msoi002j/msoi002j.pdf; DatasheetVersion: SBOS448F; PackageVersion: 4040047-3/M, 06/2011; PartNumber: INA219AIDR; Code_JEDEC: MS-012; ComponentLink2Description: Datasheet; CMRR(Min)(dB): 100
U?#1 U?#2 = CMP-04895-000152-1: IC OPAMP GP 2 CIRCUIT 8SOIC

## Sheet USB Communication.SchDoc
size 431 x 279 mm; SheetNumber: 3; SheetTotal: 6
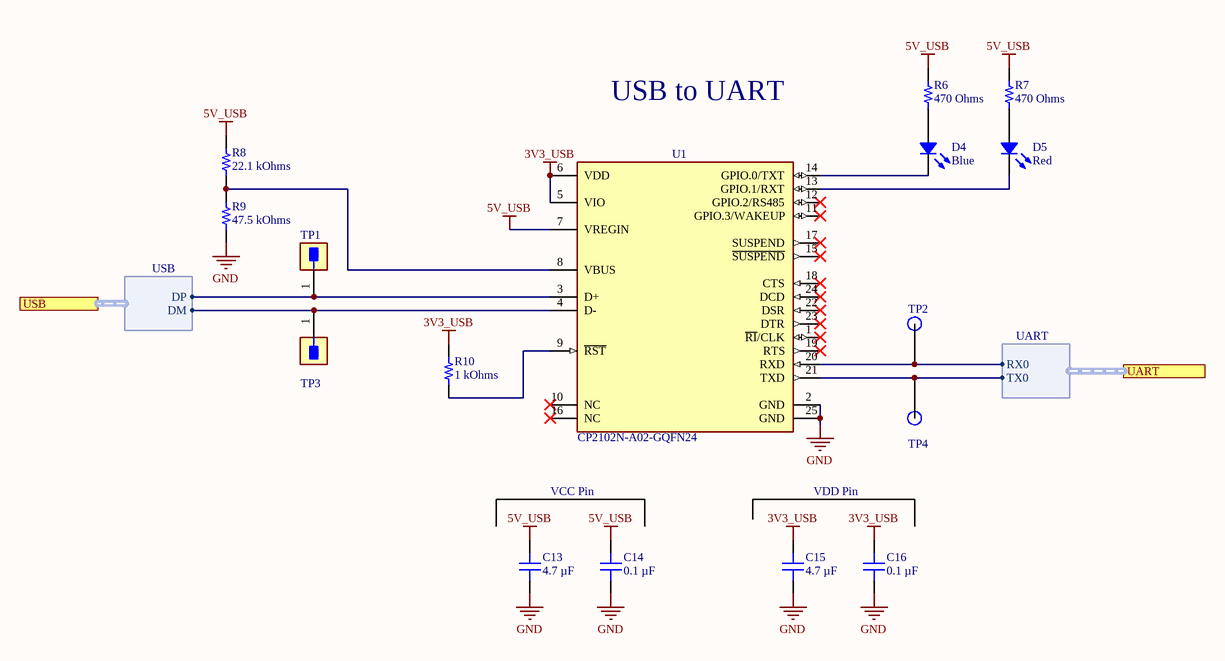
[diagram p3: USB Communication.SchDoc]

### Parts
C13  4.7 µF  [CAP 0603_1608]
C14  0.1 µF  [CAP 0603_1608]
C15  4.7 µF  [CAP 0603_1608]
C16  0.1 µF  [CAP 0603_1608]
D4  Blue  [LED 0603_1608 BLUE]
D5  Red  [LED 0603_1608 RED]
R6  470 Ohms  [RES 0603_1608]
R7  470 Ohms  [RES 0603_1608]
R8  22.1 kOhms  [RES 0603_1608]
R9  47.5 kOhms  [RES 0603_1608]
R10  1 kOhms  [RES 0603_1608]
TP1  S2751-46R  [FP-S2751-46R-MFG]  (value not drawn)
TP2  1.5mm Test Point  [1mm Test Point-Footprint-1]  (value not drawn)
TP3  S2751-46R  [FP-S2751-46R-MFG]  (value not drawn)
TP4  1.5mm Test Point  [1mm Test Point-Footprint-1]  (value not drawn)
U1  CP2102N-A02-GQFN24  [FP-CP2102N-A02-GQFN24-MFG]

### Ports
UART (harness UART), USB (harness USB)

### Harnesses
USB: DM, DP
UART: RX0, TX0

### Nets
3V3_USB: C15.2 C16.2 R10.2 U1.5(VIO) U1.6(VDD)
5V_USB: C13.2 C14.2 R6.1 R7.1 R8.2 U1.7(VREGIN)
GND: C13.1 C14.1 C15.1 C16.1 R9.1 U1.2(GND) U1.25(GND)
NetD4_1: D4.1 R6.2
NetD4_2: D4.2 U1.14(GPIO.0/TXT)
NetD5_1: D5.1 R7.2
NetD5_2: D5.2 U1.13(GPIO.1/RXT)
NetR8_1: R8.1 R9.2 U1.8(VBUS)
NetR10_1: R10.1 U1.9(~{RST})
NetTP1_1: TP1.1 U1.3(D+) ; port USB.DP
NetTP2_1: TP2.1 U1.20(RXD) ; port UART.RX0
NetTP3_1: TP3.1 U1.4(D-) ; port USB.DM
NetTP4_1: TP4.1 U1.21(TXD) ; port UART.TX0

Not connected (* = marked no-connect by the designer): U1 1(~{RI}/CLK)* 10(NC)* 11(GPIO.3/WAKEUP)* 12(GPIO.2/RS485)* 15(~{SUSPEND})* 16(NC)* 17(SUSPEND)* 18(CTS)* 19(RTS)* 22(DSR)* 23(DTR)* 24(DCD)*

### Notes on the sheet
- USB to UART
- VCC Pin
- VDD Pin
- DWG. NO.
- REV.
- SHT.
- THIS DOCUMENT AND THE DATA DISCLOSED HEREIN OR HEREWITH IS THE PROPERTY OF ALTIUM LIMITED AND MAY BE FREELY DISTRIBUTED IN WHOLE. NO RIGHTS ARE RESERVED OR EXPRESS OR IMPLIED WARANTEE GIVEN.
- REVISION
- DESCRIPTION
- DATE
- APPROVED
- ENG:
- APPROVALS
- PROJECT
- DSN:
- CHK:
- REFERENCE DOCUMENTS
- PROJECT REVISION:
- TITLE
- DOCUMENT REVISION:
- DESIGN ITEM:
- BOM:
- FAB DWG:
- PCB DWG:
- ASSY DWG:
- SCALE:
- SIZE
- B
- CAGE CODE
- FILE NAME
- DWG NO.
- SHEET
- OF
- REV

### Library data of the parts
C13 C15 = CL10A475KP8NNNC: as C5 on sheet Microcontroller; Part Number: CL10A475KP8NNNC; Value: 4.7 µF; Applications: General Purpose; Capacitance: 4.7 µF; componentlink1description: Datasheet; componentlink1url: http://www.samsungsem.com/kr/support/product-search/mlcc/CL10A475KP8NNNC.jsp; componentlink2description: DigiKey Link; componentlink2url: https://www.digikey.com/en/products/detail/samsung-electro-mechanics/CL10A475KP8NNNC/3886702; Device Package: 0603 (1608 Metric); lastupdated: 2022-09-13 6:40:44 AM; Lifecycle Status: Active; Minimum Order: 1; Mounting Type: Surface Mount, MLCC; Operating Temperature: -55°C ~ 85°C; Package / Case: 0603 (1608 Metric); packaging: TapeAndReel; partid: 5671; Part Status: Active; price: 0.01; series: CL; Size / Dimension: 0.063" L x 0.031" W (1.60mm x 0.80mm); Supplier 1: DigiKey; Supplier Part Number 1: 1276-1044-1-ND; Temperature Coefficient: X5R; Thickness (Max): 0.035" (0.90mm); Voltage - Rated: 10V
C14 C16 = C0603C104K5RAC7411: as C1 on sheet Microcontroller; Part Number: C0603C104K5RAC7411; Value: 0.1 µF; Applications: Bypass, Decoupling; Capacitance: 0.1 µF; componentlink1description: Datasheet; componentlink1url: https://api.kemet.com/component-edge/download/datasheet/C0603C104K5RAC7411.pdf; componentlink2description: DigiKey Link; componentlink2url: https://www.digikey.com/en/products/detail/kemet/C0603C104K5RAC7411/3317013; Device Package: 0603 (1608 Metric); lastupdated: 2022-09-13 6:40:53 AM; Lifecycle Status: Active; Minimum Order: 15000; Mounting Type: Surface Mount, MLCC; Operating Temperature: -55°C ~ 125°C; Package / Case: 0603 (1608 Metric); packaging: TapeAndReel; partid: 2233; Part Status: Active; price: 0.01; series: SMD Comm X7R; Size / Dimension: 0.063" L x 0.031" W (1.60mm x 0.80mm); Supplier 1: DigiKey; Supplier Part Number 1: 399-7374-2-ND; Temperature Coefficient: X7R; Thickness (Max): 0.035" (0.90mm); Voltage - Rated: 50V
D4 = LTST-C193TBKT-5A: as D1 on sheet Microcontroller; Part Number: LTST-C193TBKT-5A; Color: Blue; ComponentLink1Description: Datasheet; ComponentLink1URL: //media.digikey.com/pdf/Data%20Sheets/Lite-On%20PDFs/LTST-C193TBKT-5A.pdf; ComponentLink2Description: DigiKey Link; ComponentLink2URL: http://digikey.com/product-detail/en/lite-on-inc/LTST-C193TBKT-5A/160-1827-1-ND/2355044; Device Package: 0603 (1608 Metric); Height (Max): 0.45mm; LastUpdated: 2022-09-13 7:29:17 AM; Lens Transparency: Clear; Lifecycle Status: Active; Minimum Order: 1; Mounting Type: Surface Mount; Package / Case: 0603 (1608 Metric); Packaging: TapeAndReel; PartId: 829; Part Status: Active; Price: 0.06; Series: -; Size / Dimension: 1.60mm L x 0.80mm W; Supplier 1: DigiKey; Supplier Part Number 1: 160-1827-1-ND; Supplier Device Package: Chip LED; Value: Blue
D5 = LTST-C190KAKT: as D2 on sheet Microcontroller; Part Number: LTST-C190KAKT; Color: Red; ComponentLink1Description: Datasheet; ComponentLink1URL: //media.digikey.com/pdf/Data%20Sheets/Lite-On%20PDFs/LTST-C150,170,190KxKT.pdf; ComponentLink2Description: DigiKey Link; ComponentLink2URL: http://digikey.com/product-detail/en/lite-on-inc/LTST-C190KAKT/160-1433-1-ND/386810; Device Package: 0603 (1608 Metric); Height (Max): 0.90mm; LastUpdated: 2022-09-13 7:29:57 AM; Lens Transparency: Clear; Lifecycle Status: Active; Minimum Order: 1; Mounting Type: Surface Mount; Package / Case: 0603 (1608 Metric); Packaging: TapeAndReel; PartId: 384; Part Status: Active; Price: 0.07; Series: -; Size / Dimension: 1.60mm L x 0.80mm W; Supplier 1: DigiKey; Supplier Part Number 1: 160-1433-1-ND; Supplier Device Package: Chip LED; Value: Red
R6 R7 = ERJ-3EKF4700V: RES SMD 470 OHM 1% 1/10W 0603; Manufacturer: Panasonic Electronic Components; Power (Watts): 0.1W, 1/10W; Temperature Coefficient: ±100ppm/°C; Part Number: ERJ-3EKF4700V; Value: 470 Ohms; ComponentLink1Description: Datasheet; ComponentLink1URL: https://industrial.panasonic.com/cdbs/www-data/pdf/RDA0000/AOA0000C304.pdf; ComponentLink2Description: DigiKey Link; ComponentLink2URL: https://www.digikey.com/en/products/detail/panasonic-electronic-components/ERJ-3EKF4700V/1746417; Composition: Thick Film; Device Package: 0603 (1608 Metric); Features: Automotive AEC-Q200; Height - Seated (Max): 0.022" (0.55mm); LastUpdated: 2022-09-14 8:09:45 AM; Lifecycle Status: Active; Minimum Order: 1; Number of Terminations: 2; Operating Temperature: -55°C ~ 155°C; Package / Case: 0603 (1608 Metric); Packaging: TapeAndReel; PartId: 5664; Part Status: Active; Price: 0.01; Ratings: AEC-Q200; Resistance: 470 Ohms; Series: ERJ-3EK; Size / Dimension: 0.063" L x 0.031" W (1.60mm x 0.80mm); Supplier 1: DigiKey; Supplier Part Number 1: P470HCT-ND; Supplier Device Package: 0603; Tolerance: ±1%
R8 = RMCF0603FT22K1: RES 22.1K OHM 1% 1/10W 0603; Manufacturer: Stackpole Electronics Inc; Power (Watts): 0.1W, 1/10W; Temperature Coefficient: ±100ppm/°C; Part Number: RMCF0603FT22K1; Value: 22.1 kOhms; ComponentLink1Description: Datasheet; ComponentLink1URL: https://www.seielect.com/catalog/sei-rmcf_rmcp.pdf; ComponentLink2Description: DigiKey Link; ComponentLink2URL: https://www.digikey.com/en/products/detail/stackpole-electronics-inc/RMCF0603FT22K1/1760764; Composition: Thick Film; Device Package: 0603 (1608 Metric); Features: Automotive AEC-Q200; Height - Seated (Max): 0.022" (0.55mm); LastUpdated: 2022-09-19 1:22:30 PM; Lifecycle Status: Active; Minimum Order: 1; Number of Terminations: 2; Operating Temperature: -55°C ~ 155°C; Package / Case: 0603 (1608 Metric); Packaging: CutTape; PartId: 6076; Part Status: Active; Price: 0.01; Ratings: AEC-Q200; Resistance: 22.1 kOhms; Series: RMCF; Size / Dimension: 0.061" L x 0.031" W (1.55mm x 0.80mm); Supplier 1: DigiKey; Supplier Part Number 1: RMCF0603FT22K1CT-ND; Supplier Device Package: 0603; Tolerance: ±1%
R9 = RMCF0603FT47K5: RES 47.5K OHM 1% 1/10W 0603; Manufacturer: Stackpole Electronics Inc; Power (Watts): 0.1W, 1/10W; Temperature Coefficient: ±100ppm/°C; Part Number: RMCF0603FT47K5; Value: 47.5 kOhms; ComponentLink1Description: Datasheet; ComponentLink1URL: https://www.seielect.com/catalog/sei-packaging.pdf; ComponentLink2Description: DigiKey Link; ComponentLink2URL: https://www.digikey.com/en/products/detail/stackpole-electronics-inc/RMCF0603FT47K5/1761143; Composition: Thick Film; Device Package: 0603 (1608 Metric); Features: Automotive AEC-Q200; Height - Seated (Max): 0.022" (0.55mm); LastUpdated: 2022-09-19 1:22:13 PM; Lifecycle Status: Active; Minimum Order: 1; Number of Terminations: 2; Operating Temperature: -55°C ~ 155°C; Package / Case: 0603 (1608 Metric); Packaging: CutTape; PartId: 10609; Part Status: Active; Price: 0.01; Ratings: AEC-Q200; Resistance: 47.5 kOhms; Series: RMCF; Size / Dimension: 0.061" L x 0.031" W (1.55mm x 0.80mm); Supplier 1: DigiKey; Supplier Part Number 1: RMCF0603FT47K5CT-ND; Supplier Device Package: 0603; Tolerance: ±1%
R10 = CRCW06031K00FKEB: RES SMD 1K OHM 1% 1/10W 0603; Manufacturer: Vishay Dale; Power (Watts): 0.1W, 1/10W; Temperature Coefficient: ±100ppm/°C; Part Number: CRCW06031K00FKEB; Value: 1 kOhms; ComponentLink1Description: Datasheet; ComponentLink1URL: http://www.vishay.com/docs/20035/dcrcwe3.pdf; ComponentLink2Description: DigiKey Link; ComponentLink2URL: http://digikey.com/product-detail/en/vishay-dale/CRCW06031K00FKEB/541-2985-1-ND/6073628; Composition: Thick Film; Device Package: 0603 (1608 Metric); Features: Automotive AEC-Q200; Height - Seated (Max): 0.020" (0.50mm); LastUpdated: 2022-09-19 1:22:33 PM; Lifecycle Status: Active; Minimum Order: 1; Number of Terminations: 2; Operating Temperature: -55°C ~ 155°C; Package / Case: 0603 (1608 Metric); Packaging: CutTape; PartId: 5123; Part Status: Active; Price: 0.10; Ratings: AEC-Q200; Resistance: 1 kOhms; Series: CRCW; Size / Dimension: 0.063" L x 0.033" W (1.60mm x 0.85mm); Supplier 1: DigiKey; Supplier Part Number 1: 541-2985-1-ND; Supplier Device Package: 0603; Tolerance: ±1%
TP1 TP3 = CMP-00053-4: Conn Test Point 1 POS Solder ST SMD 1 Port T/R; Body Material: Brass; Plating: Tin; Packaging: Cut Tape; Series: S2751, EZ BoardWare; Material: Copper Alloy; Color: Natural; Mount: Surface Mount
TP2 TP4 = CMP-002-00006-1: 1.5mm Test Point 0.75mm hole size
U1 = CMP-08107-000010-1: IC USB TO UART BRIDGE QFN24